# Altium schematic sheet [05] - PERIPHERALS.SchDoc
size A4; DocumentNumber: 3; SheetNumber: 3; SheetTotal: 6
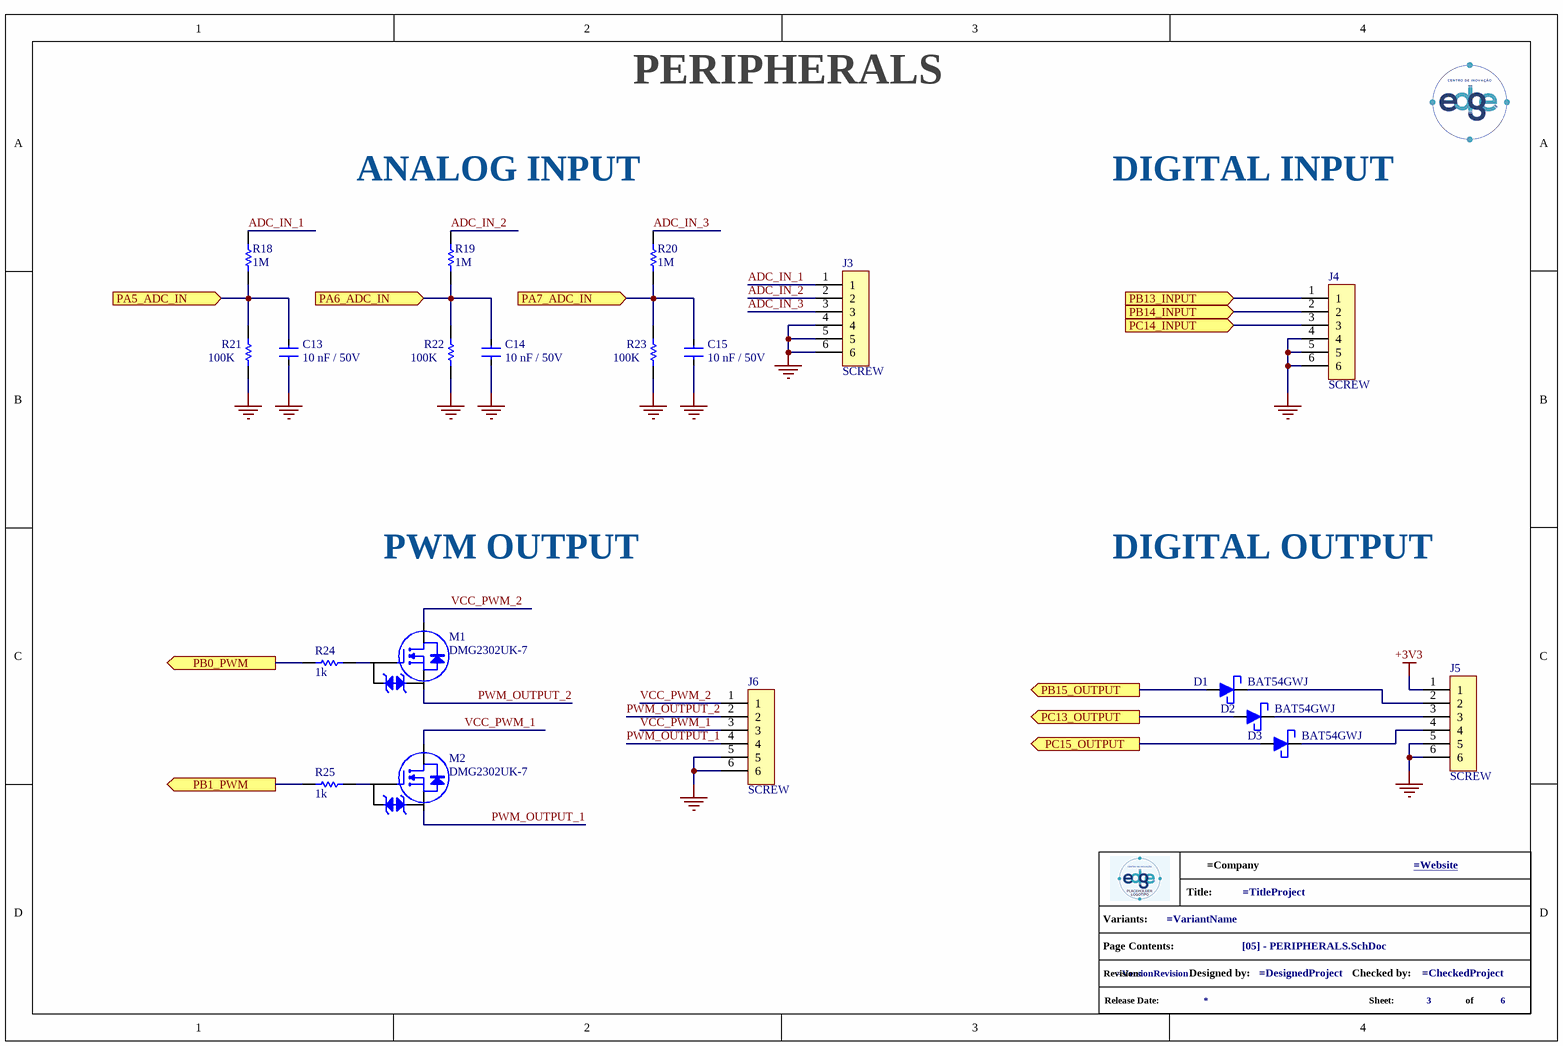
[diagram p0: [05] - PERIPHERALS.SchDoc]

## Parts
*?  info_project  (value not drawn)  (graphical)
C13  10 nF / 50V  [C0805]
C14  10 nF / 50V  [C0805]
C15  10 nF / 50V  [C0805]
D1  BAT54GWJ  [SOD123]
D2  BAT54GWJ  [SOD123]
D3  BAT54GWJ  [SOD123]
J3  SCREW  [SCREW-6P]
J4  SCREW  [SCREW-6P]
J5  SCREW  [SCREW-6P]
J6  SCREW  [SCREW-6P]
M1  DMG2302UK-7  [SOT23]
M2  DMG2302UK-7  [SOT23]
R18  1M  [R0805]
R19  1M  [R0805]
R20  1M  [R0805]
R21  100K  [R0805]
R22  100K  [R0805]
R23  100K  [R0805]
R24  1k  [R0805]
R25  1k  [R0805]

## Ports
PA5_ADC_IN (in), PA6_ADC_IN (in), PA7_ADC_IN (in), PB0_PWM (out), PB1_PWM (out), PB13_INPUT (in), PB14_INPUT (in), PB15_OUTPUT (out), PC13_OUTPUT (out), PC14_INPUT (in), PC15_OUTPUT (out)

## Nets
+3V3: J5.1
GND: C13.1 C14.1 C15.1 J3.4 J3.5 J3.6 J4.4 J4.5 J4.6 J5.5 J5.6 J6.5 J6.6 R21.1 R22.1 R23.1
ADC_IN_1: J3.1 R18.2
ADC_IN_2: J3.2 R19.2
ADC_IN_3: J3.3 R20.2
PA5_ADC_IN: C13.2 R18.1 R21.2 ; port PA5_ADC_IN
PA6_ADC_IN: C14.2 R19.1 R22.2 ; port PA6_ADC_IN
PA7_ADC_IN: C15.2 R20.1 R23.2 ; port PA7_ADC_IN
PB0_PWM: R24.1 ; port PB0_PWM
PB1_PWM: R25.1 ; port PB1_PWM
PB13_INPUT: J4.1 ; port PB13_INPUT
PB14_INPUT: J4.2 ; port PB14_INPUT
PB15_OUTPUT: D1.2 ; port PB15_OUTPUT
PC13_OUTPUT: D2.2 ; port PC13_OUTPUT
PC14_INPUT: J4.3 ; port PC14_INPUT
PC15_OUTPUT: D3.2 ; port PC15_OUTPUT
PWM_OUTPUT_1: J6.4 M2.2(S)
PWM_OUTPUT_2: J6.2 M1.2(S)
VCC_PWM_1: J6.3 M2.3(D)
VCC_PWM_2: J6.1 M1.3(D)
NetD1_1: D1.1 J5.2
NetD2_1: D2.1 J5.3
NetD3_1: D3.1 J5.4
NetM1_1: M1.1(G) R24.2
NetM2_1: M2.1(G) R25.2

## Notes on the sheet
- PERIPHERALS
- ANALOG INPUT
- DIGITAL INPUT
- PWM OUTPUT
- DIGITAL OUTPUT
- (in symbol info_project) Title:; Variants:; Page Contents:; Revision:; Designed by:; Checked by:; Release Date:; Sheet:; of

## Library data of the parts
C13-C15 = C0805C103J5GEC7800: MLCC - 10nF 50V 0805 C0G +/- 5%; Manufacturer: KEMET; Supplier 1: Digi-Key; Manufacturer Part Number: C0805C103J5GEC7800; RoHS: No; Stock 1: 1119; Pricing 1: 1=0.31000, 10=0.21500, 50=0.14300, 100=0.12160, 500=0.08584, 1000=0.07511 (USD); Supplier Part Number 1: 399-C0805C103J5GEC7800CT-ND
D1-D3 = BAT54GWJ: DIODE SCHOTTKY 30 V - 200 mA SOD123; Manufacturer: Nexperia USA; Max Reverse Voltage (DC): 30V; Average Rectified Current: 200mA; Supplier 1: Newark; Manufacturer Part Number: BAT54GWJ; RoHS: No; Mount: Surface Mount; Min Operating Temperature: -40°C; Max Operating Temperature: 85°C; Packaging: Cut Tape; ComponentLink1URL: https://assets.nexperia.com/documents/data-sheet/BAT54GW.pdf?src-supplier=Digi-Key; ComponentLink1Description: https://assets.nexperia.com/documents/data-sheet/BAT54GW.pdf?src-supplier=Digi-Key; Supplier Part Number 1: 73AH9681
J3-J6 = 282834-6: TERM BLK 6P SIDE 2.54MM; Manufacturer: TE Connectivity; Plating: Brass,Steel; Number of Contacts: 6; Current Rating: 10A; Voltage Rating: 150V; Number of Levels: 1; Connector Type: Receptacle; Closed End: No (Without); Screwless Terminal Block: Yes (With); Gender: Female; Wire Gauge (Max): 30AWG; Wire Gauge (Min): 16AWG; Thread Size: M1.6; Tail Length: 3.4mm; Approvals: UL; Supplier 1: Digi-Key; Manufacturer Part Number: 282834-6; RoHS: Yes; Category: Terminal Blocks; Stock 1: 7269; Pricing 1: 1=5,33000, 10=4,06500, 25=3,80720, 50=3,38400, 100=3,31050, 250=3,05300, 500=2,75874, 1000=2,45221 (USD); Mount: Through Hole; Color: Green; Contact Plating: Tin; Contact Material: Brass; Housing Color: Green; Housing Material: Polyamide; Material: Nylon; Min Operating Temperature: -40°C; Max Operating Temperature: 105°C; Termination: Solder; Orientation: Straight; Package Quantity: 100; Packaging: Box; Number of Rows: 1; Series: Buchanan; Number of Positions Per Level: 6; Current: 10A; Voltage: 150V; Number of Positions: 6; Number of Circuits: 6; Max Current Rating: 10A; Interlock: No (Without); Screw Flange: No (Without); Side Stackable: Yes (With); Max Supply Voltage (AC): 150V; Number of Poles: 6; Max Voltage Rating (AC): 150V; Length: 15.7mm; Width: 6.5mm; Pitch: 2.54mm; Depth: 6.5mm; Wire/Cable Gauge: 30AWG; Radiation Hardening: No; Flammability Rating: UL94 V-0; ELV: Compliant; REACH SVHC: Unknown; Lead Free: Lead Free; ComponentLink1URL: https://datasheet.ciiva.com/823/eng-cd-282834-c1-823488.pdf?src-supplier=Digi-Key; ComponentLink1Description: https://datasheet.ciiva.com/823/eng-cd-282834-c1-823488.pdf?src-supplier=Digi-Key; ComponentLink2URL: https://datasheet.ciiva.com/16308/282834-6-16308413.pdf?src-supplier=Future+Electronics; ComponentLink2Description: https://datasheet.ciiva.com/16308/282834-6-16308413.pdf?src-supplier=Future+Electronics; ComponentLink3URL: https://datasheet.ciiva.com/25618/0900766b810c7187-25618156.pdf?src-supplier=RSComponents; ComponentLink3Description: https://datasheet.ciiva.com/25618/0900766b810c7187-25618156.pdf?src-supplier=RSComponents; ComponentLink4URL: https://datasheet.ciiva.com/9370/eng-cs-1308389-eurostyle-terminal-blocks-0607-9370422.pdf?src-supplier=Avnet; ComponentLink4Description: https://datasheet.ciiva.com/9370/eng-cs-1308389-eurostyle-terminal-blocks-0607-9370422.pdf?src-supplier=Avnet; ComponentLink5URL: https://datasheet.ciiva.com/16676/eng-cs-1308389-eurostyle-terminal-blocks-0607-16676062.pdf?src-supplier=Avnet+Europe; ComponentLink5Description: https://datasheet.ciiva.com/16676/eng-cs-1308389-eurostyle-terminal-blocks-0607-16676062.pdf?src-supplier=Avnet+Europe; ComponentLink6URL: https://datasheet.ciiva.com/30097/eng-cs-1308389-eurostyle-terminal-blocks-0607-30097352.pdf?src-supplier=Onlinecomponents.com; ComponentLink6Description: https://datasheet.ciiva.com/30097/eng-cs-1308389-eurostyle-terminal-blocks-0607-30097352.pdf?src-supplier=Onlinecomponents.com; Supplier Part Number 1: A98337-ND
M1 M2 = DMG2302UK-7: MOSFET N-CHANNEL 20 V, 2.8 A, 0.061 OHM, SOT-23; Manufacturer: Diodes; Drain to Source Voltage (Vdss): 20V; Continuous Drain Current (ID): 2.8A; Rds On Max: 90mR; Input Capacitance: 130pF; Max Power Dissipation: 660mW; Supplier 1: Digi-Key; Manufacturer Part Number: DMG2302UK-7; RoHS: Yes; Category: MOSFETs; Stock 1: 678413; Pricing 1: 1=0,37000, 10=0,27900, 100=0,15800, 500=0,10460, 1000=0,08020 (USD); Mount: Surface Mount; Case/Package: TO-236-3; Min Operating Temperature: -55°C; Max Operating Temperature: 150°C; Packaging: Tape and Reel; RoHS Compliant: Yes; ComponentLink1URL: http://www.farnell.com/datasheets/2814387.pdf?src-supplier=Farnell; ComponentLink1Description: http://www.farnell.com/datasheets/2814387.pdf?src-supplier=Farnell; ComponentLink2URL: https://www.diodes.com/assets/Datasheets/DMG2302UK.pdf?src-supplier=Digi-Key; ComponentLink2Description: https://www.diodes.com/assets/Datasheets/DMG2302UK.pdf?src-supplier=Digi-Key; ComponentLink3URL: http://www.farnell.com/datasheets/2814387.pdf?src-supplier=Element14; ComponentLink3Description: http://www.farnell.com/datasheets/2814387.pdf?src-supplier=Element14; ComponentLink4URL: http://www.farnell.com/datasheets/2814387.pdf?src-supplier=Newark; ComponentLink4Description: http://www.farnell.com/datasheets/2814387.pdf?src-supplier=Newark; Supplier Part Number 1: DMG2302UK-7DICT-ND
R18-R20 = RMCF0805FT1M00: RES - 1M 1/8W 0805 1%; Manufacturer: Stackpole Electronics; Resistance: 1MR; Power Rating: 125mW; Temperature Coefficient: 100ppm/°C; Supplier 1: Digi-Key; Manufacturer Part Number: RMCF0805FT1M00; RoHS: Yes; Category: Chip SMD Resistors; Stock 1: 412220; Pricing 1: 1=0,10000, 10=0,02700, 100=0,01090, 1000=0,00488, 2500=0,00423 (USD); Mount: Surface Mount; Case/Package: 0805; Case Code (Metric): 2012; Case Code (Imperial): 0805; Contact Plating: Tin,Matte; Size Code: 0805; Min Operating Temperature: -55°C; Max Operating Temperature: 155°C; Tolerance: 1%; Packaging: Tape and Reel; Resistor Type: Thick Film; Number of Terminations: 2; Max Power Dissipation: 125mW; Features: Automotive AEC-Q200; Series: RMCF; Construction: Rectangular; Length: 2mm; Width: 0.049inch; Height: 0.026inch; Depth: 1.25mm; Radiation Hardening: No; Military Standard: Not; Lead Free: Lead Free; RoHS Compliant: Yes; ComponentLink1URL: http://components.arrow.com/part/dataview/50575311S7171767N1174?src-supplier=Arrow+Electronics; ComponentLink1Description: http://components.arrow.com/part/dataview/50575311S7171767N1174?src-supplier=Arrow+Electronics; ComponentLink2URL: https://www.seielect.com/catalog/SEI-Packaging.pdf?src-supplier=Digi-Key; ComponentLink2Description: https://www.seielect.com/catalog/SEI-Packaging.pdf?src-supplier=Digi-Key; ComponentLink3URL: http://www.seielect.com/Catalog/SEI-rmc.pdf?src-supplier=Future+Electronics; ComponentLink3Description: http://www.seielect.com/Catalog/SEI-rmc.pdf?src-supplier=Future+Electronics; ComponentLink4URL: https://www.seielect.com/catalog/SEI-RMCF_RMCP.pdf?src-supplier=Avnet; ComponentLink4Description: https://www.seielect.com/catalog/SEI-RMCF_RMCP.pdf?src-supplier=Avnet; ComponentLink5URL: https://www.verical.com/server-webapp/html/getDatasheet?partID=366460&src-supplier=Verical; ComponentLink5Description: https://www.verical.com/server-webapp/html/getDatasheet?partID=366460&src-supplier=Verical; Supplier Part Number 1: RMCF0805FT1M00CT-ND
R21-R23 = RC0805FR-07100KL: RES - 100K 1/8W 0805 1%; Manufacturer: Yageo; Resistance: 100kR; Temperature Coefficient: 100ppm/°C; Power Rating: 125mW; Voltage Rating (DC): 150V; Supplier 1: Digi-Key; Manufacturer Part Number: RC0805FR-07100KL; RoHS: Yes; Category: Chip SMD Resistors; Stock 1: 650822; Pricing 1: 1=0,10000, 10=0,04200, 100=0,01690, 1000=0,00759, 2500=0,00659 (USD); Case/Package: 0805; Number of Pins: 2; Case Code (Metric): 2012; Case Code (Imperial): 0805; Size Code: 0805; Min Operating Temperature: -55°C; Max Operating Temperature: 155°C; Resistor Type: Thick Film; Tolerance: 1%; Packaging: Tape and Reel; Voltage Rating: 150V; Package Quantity: 1; Number of Terminations: 2; Termination: SMD/SMT; Max Power Dissipation: 125mW; Features: Moisture Resistant; Series: RC; Construction: Rectangular; Resistance Tolerance: 1%; Technology: THICK FILM; Length: 2mm; Width: 0.049inch; Height: 0.024inch; Depth: 1.25mm; Lead Pitch: 0.4mm; REACH SVHC: Unknown; Lead Free: Lead Free; RoHS Compliant: Yes; Military Standard: Not; ComponentLink1URL: https://datasheet.ciiva.com/11808/0900766b8106beab-11808858.pdf?src-supplier=RSComponents; ComponentLink1Description: https://datasheet.ciiva.com/11808/0900766b8106beab-11808858.pdf?src-supplier=RSComponents; ComponentLink2URL: https://datasheet.ciiva.com/7941/1686128-7941677.pdf?src-supplier=Element14; ComponentLink2Description: https://datasheet.ciiva.com/7941/1686128-7941677.pdf?src-supplier=Element14; ComponentLink3URL: https://datasheet.ciiva.com/7660/38627-7660796.pdf?src-supplier=Element14; ComponentLink3Description: https://datasheet.ciiva.com/7660/38627-7660796.pdf?src-supplier=Element14; ComponentLink4URL: https://datasheet.ciiva.com/22747/444164-22747534.pdf?src-supplier=Element14; ComponentLink4Description: https://datasheet.ciiva.com/22747/444164-22747534.pdf?src-supplier=Element14; ComponentLink5URL: https://datasheet.ciiva.com/2457/pyu-r-int-thick-7-2457018.pdf?src-supplier=Digi-Key; ComponentLink5Description: https://datasheet.ciiva.com/2457/pyu-r-int-thick-7-2457018.pdf?src-supplier=Digi-Key; ComponentLink6URL: https://datasheet.ciiva.com/2457/pyu-r-int-thick-7-2457019.pdf?src-supplier=Digi-Key; ComponentLink6Description: https://datasheet.ciiva.com/2457/pyu-r-int-thick-7-2457019.pdf?src-supplier=Digi-Key; ComponentLink7URL: https://datasheet.ciiva.com/2457/pyu-r-int-thick-7-2457017.pdf?src-supplier=Digi-Key; ComponentLink7Description: https://datasheet.ciiva.com/2457/pyu-r-int-thick-7-2457017.pdf?src-supplier=Digi-Key; ComponentLink8URL: https://datasheet.ciiva.com/12667/rc0805-12667001.pdf?src-supplier=Mouser; ComponentLink8Description: https://datasheet.ciiva.com/12667/rc0805-12667001.pdf?src-supplier=Mouser; ComponentLink9URL: https://datasheet.ciiva.com/7941/1697719-7941676.pdf?src-supplier=Element14; ComponentLink9Description: https://datasheet.ciiva.com/7941/1697719-7941676.pdf?src-supplier=Element14; ComponentLink10URL: https://datasheet.ciiva.com/7941/1697719-7941678.pdf?src-supplier=Element14; ComponentLink10Description: https://datasheet.ciiva.com/7941/1697719-7941678.pdf?src-supplier=Element14; ComponentLink11URL: https://datasheet.ciiva.com/16747/rc0805-16747226.pdf?src-supplier=Future+Electronics; ComponentLink11Description: https://datasheet.ciiva.com/16747/rc0805-16747226.pdf?src-supplier=Future+Electronics; Supplier Part Number 1: 311-100KCRCT-ND
R24 R25 = RC0805FR-071KL: RES - 1K 1/8W 0805 1%; Manufacturer: Yageo; Resistance: 1kR; Temperature Coefficient: 100ppm/°C; Voltage Rating (DC): 150V; Power Rating: 125mW; Supplier 1: Digi-Key; Manufacturer Part Number: RC0805FR-071KL; RoHS: Yes; Category: Chip SMD Resistors; Stock 1: 7991149; Pricing 1: 1=0,10000, 10=0,04200, 100=0,01690, 1000=0,00759, 2500=0,00659 (USD); Case/Package: 0805; Number of Pins: 2; Case Code (Metric): 2012; Case Code (Imperial): 0805; Size Code: 0805; Min Operating Temperature: -55°C; Max Operating Temperature: 155°C; Tolerance: 1%; Resistor Type: Thick Film; Packaging: Tape and Reel; Package Quantity: 1; Voltage Rating: 150V; Number of Terminations: 2; Termination: SMD/SMT; Max Power Dissipation: 125mW; Features: Moisture Resistant; Series: RC; Resistance Tolerance: 1%; Construction: Rectangular; Length: 0.079inch; Width: 0.049inch; Height: 0.024inch; Depth: 1.25mm; REACH SVHC: Unknown; Lead Free: Lead Free; RoHS Compliant: Yes; Military Standard: Not; ComponentLink1URL: https://datasheet.ciiva.com/46385/444164-46385020.pdf?src-supplier=Element14; ComponentLink1Description: https://datasheet.ciiva.com/46385/444164-46385020.pdf?src-supplier=Element14; ComponentLink2URL: https://datasheet.ciiva.com/2456/pyu-r-int-thick-7-2456975.pdf?src-supplier=Digi-Key; ComponentLink2Description: https://datasheet.ciiva.com/2456/pyu-r-int-thick-7-2456975.pdf?src-supplier=Digi-Key; ComponentLink3URL: https://datasheet.ciiva.com/2456/pyu-r-int-thick-7-2456976.pdf?src-supplier=Digi-Key; ComponentLink3Description: https://datasheet.ciiva.com/2456/pyu-r-int-thick-7-2456976.pdf?src-supplier=Digi-Key; ComponentLink4URL: https://datasheet.ciiva.com/2456/pyu-r-int-thick-7-2456977.pdf?src-supplier=Digi-Key; ComponentLink4Description: https://datasheet.ciiva.com/2456/pyu-r-int-thick-7-2456977.pdf?src-supplier=Digi-Key; ComponentLink5URL: https://datasheet.ciiva.com/16850/rc0805-16850409.pdf?src-supplier=Future+Electronics; ComponentLink5Description: https://datasheet.ciiva.com/16850/rc0805-16850409.pdf?src-supplier=Future+Electronics; ComponentLink6URL: https://datasheet.ciiva.com/7941/1686128-7941719.pdf?src-supplier=Element14; ComponentLink6Description: https://datasheet.ciiva.com/7941/1686128-7941719.pdf?src-supplier=Element14; Supplier Part Number 1: 311-1.00KCRCT-ND